# Altium schematic sheet Power management.SchDoc
size A4; SheetNumber: 2; SheetTotal: 4
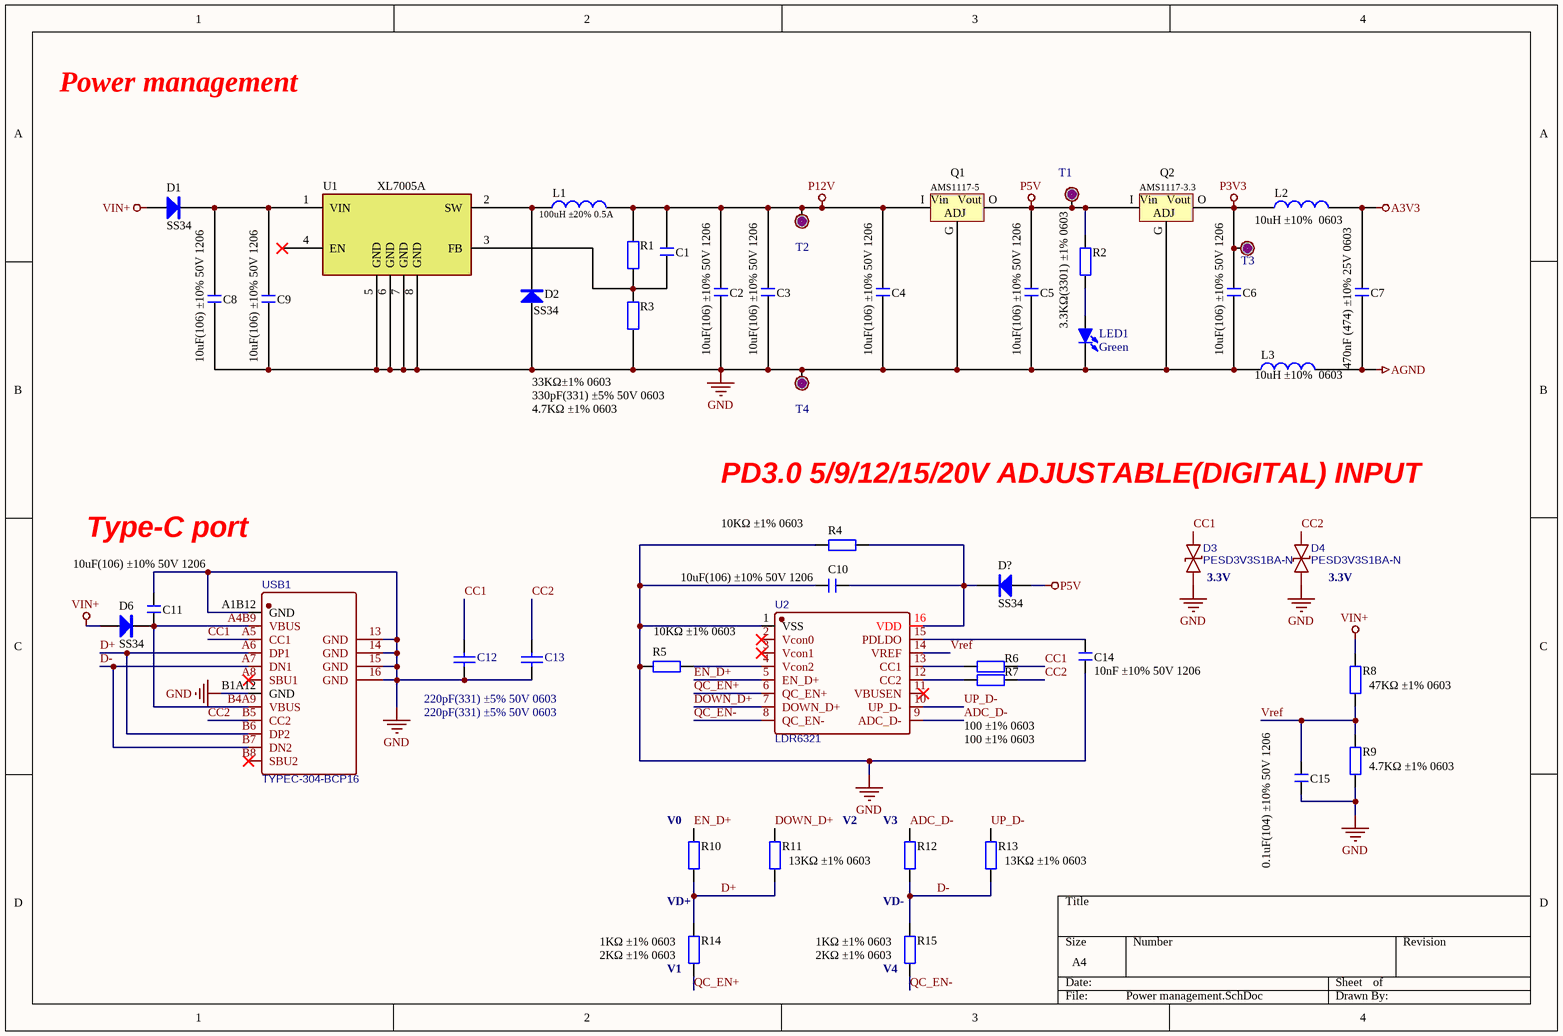
[diagram p0: Power management.SchDoc]

## Parts
C1  330pF(331) ±5% 50V 0603  [C 0603_L]
C2  10uF(106) ±10% 50V 1206  [C 1206_M]
C3  10uF(106) ±10% 50V 1206  [C 1206_M]
C4  10uF(106) ±10% 50V 1206  [C 1206_M]
C5  10uF(106) ±10% 50V 1206  [C 1206_M]
C6  10uF(106) ±10% 50V 1206  [C 1206_M]
C7  470nF (474) ±10% 25V 0603  [C 0603_L]
C8  10uF(106) ±10% 50V 1206  [C 1206_M]
C9  10uF(106) ±10% 50V 1206  [C 1206_M]
C10  10uF(106) ±10% 50V 1206  [C 1206_M]
C11  10uF(106) ±10% 50V 1206  [C 1206_M]
C12  220pF(331) ±5% 50V 0603  [C0603_L]
C13  220pF(331) ±5% 50V 0603  [C0603_L]
C14  10nF ±10% 50V 1206  [C 1206_M]
C15  0.1uF(104) ±10% 50V 1206  [C 1206_M]
D1  SS34  [SMA]
D2  SS34  [SMA]
D3  PESD3V3S1BA-N  [SOD-523_L1.2-W0.8-LS1.6-BI]
D4  PESD3V3S1BA-N  [SOD-523_L1.2-W0.8-LS1.6-BI]
D6  SS34  [SMA]
D?  SS34  [SMA]
L1  100uH ±20% 0.5A  [CDRH74]
L2  10uH ±10%  0603  [L 0603]
L3  10uH ±10%  0603  [L 0603]
LED1  Green  [LED 0603R]
Q1  AMS1117-5  [SOT-223]
Q2  AMS1117-3.3  [SOT-223]
R1  33KΩ±1% 0603  [R 0603_L]
R2  3.3KΩ(3301) ±1% 0603  [R 0603_L]
R3  4.7KΩ ±1% 0603  [R 0603_L]
R4  10KΩ ±1% 0603  [R 0603_L]
R5  10KΩ ±1% 0603  [R 0603_L]
R6  100 ±1% 0603  [R 0603_L]
R7  100 ±1% 0603  [R 0603_L]
R8  47KΩ ±1% 0603  [R 0603_L]
R9  4.7KΩ ±1% 0603  [R 0603_L]
R10  1KΩ ±1% 0603  [R 0603_L]
R11  13KΩ ±1% 0603  [R 0603_L]
R12  1KΩ ±1% 0603  [R 0603_L]
R13  13KΩ ±1% 0603  [R 0603_L]
R14  2KΩ ±1% 0603  [R 0603_L]
R15  2KΩ ±1% 0603  [R 0603_L]
T1  TestP  [TestP]  (value not drawn)
T2  TestP  [TestP]  (value not drawn)
T3  TestP  [TestP]  (value not drawn)
T4  TestP  [TestP]  (value not drawn)
U1  XL7005A  [SOP8-EP]
U2  LDR6321  [SSOP-16_L5.0-W4.4-P0.65-LS6.4-BL]
USB1  TYPEC-304-BCP16  [USB-C-SMD_TYPEC-304-BCP16]

## Nets
A3V3: C7.1 L2.2
AGND: C7.2 L3.2
GND: C2.1 C3.1 C4.1 C5.1 C6.1 C8.1 C9.1 C10.2 C11.2 C12.1 C13.1 C14.1 C15.1 D2.1(A) D3.1 D4.1 L3.1 LED1.2(K) Q1.G Q2.G R3.2 R4.1 R5.1 R9.1 T4.0 U1.5(GND) U1.6(GND) U1.7(GND) U1.8(GND) U2.1(VSS) USB1.13(GND) USB1.14(GND) USB1.15(GND) USB1.16(GND) USB1.A1B12(GND) USB1.B1A12(GND)
P3V3: C6.2 L2.1 Q2.O(OUT) T3.0
P5V: C5.2 D?.1(A) Q1.O(OUT) Q2.I(IN) R2.1 T1.0
P12V: C1.2 C2.2 C3.2 C4.2 L1.2 Q1.I(IN) R1.1 T2.0
VIN+: D1.1(A) D6.1(A) R8.2
ADC_D-: R12.2 U2.9(ADC_D-)
CC1: C12.2 D3.2 R6.2 USB1.A5(CC1)
CC2: C13.2 D4.2 R7.2 USB1.B5(CC2)
D+: R10.1 R11.1 R14.2 USB1.A6(DP1) USB1.B6(DP2)
D-: R12.1 R13.1 R15.2 USB1.A7(DN1) USB1.B7(DN2)
DOWN_D+: R11.2 U2.7(DOWN_D+)
EN_D+: R10.2 U2.5(EN_D+)
QC_EN+: R14.1 U2.6(QC_EN+)
QC_EN-: R15.1 U2.8(QC_EN-)
UP_D-: R13.2 U2.10(UP_D-)
Vref: C15.2 R8.1 R9.2 U2.14(VREF)
NetC1_1: C1.1 R1.2 R3.1 U1.3(FB)
NetC8_2: C8.2 C9.2 D1.2(K) U1.1(VIN)
NetC10_1: C10.1 D?.2(K) R4.2 U2.16(VDD)
NetC11_1: C11.1 D6.2(K) USB1.A4B9(VBUS) USB1.B4A9(VBUS)
NetC14_2: C14.2 U2.15(PDLDO)
NetD2_2: D2.2(K) L1.1 U1.2(SW)
NetLED1_1: LED1.1(A) R2.2
NetR5_2: R5.2 U2.4(Vcon2)
NetR6_1: R6.1 U2.13(CC1)
NetR7_1: R7.1 U2.12(CC2)

Not connected (* = marked no-connect by the designer): U1 4(EN)*; U2 2(Vcon0)* 3(Vcon1)* 11(VBUSEN)*; USB1 A8(SBU1)* B8(SBU2)*

## Notes on the sheet
- Power management
- PD3.0 5/9/12/15/20V ADJUSTABLE(DIGITAL) INPUT
- Type-C port
- (near D3) 3.3V
- (near D4) 3.3V
- (near R10) V0
- V2
- (near R12) V3
- VD+
- VD-
- (near R14) V1
- (near R15) V4
- (in symbol NCP1117ST50T3G) Vin; Vout; ADJ

## Library data of the parts
C1-C11 C14 C15 = C: 贴片电容; BOM名称: 无极性贴片电容; 淘宝ID: 封装库来自淘宝 ID：黄晶宝石; 联系售后，技术支持: https://shop463601444.taobao.com; 唯一出售店铺网址: https://shop463601444.taobao.com
C12 C13 = C: 贴片电容/MLCC电容; BOM名称: 无极性贴片电容; 联系卖家，免费查找封装: 唯一出售店铺网址https://shop463601444.taobao.com
D1 D2 D6 D? = 1N4007: 整流二极管; 淘宝ID: 封装库来自淘宝 ID：黄晶宝石; 封装库来自淘宝卖家 ID：黄晶宝石: 其他店铺购入均为盗版，不享受售后技术支持服务，请立即申请退款; BOM名称: 整流二极管; 联系售后，技术支持: https://shop463601444.taobao.com
D3 D4 = PESD3V3S1BA-N: TVS3V3; BOM_Manufacturer: Bourne Semicon (Shenzhen); Contributor: LCSC; BOM_Supplier: LCSC; BOM_Supplier Part: C316037; BOM_Manufacturer Part: PESD3V3S1BA-N; BOM_JLCPCB Part Class: Extended Part; spicePre: D; spiceSymbolName: PESD3V3S1BA-N
L1 = Inductor
L2 L3 = L: 小功率贴片电感; 淘宝ID: 封装库来自淘宝 ID：黄晶宝石; 封装库来自淘宝卖家 ID：黄晶宝石: 其他店铺购入均为盗版，不享受售后技术支持服务，请立即申请退款; BOM名称: 小功率贴片电感; 联系售后: https://shop463601444.taobao.com
LED1 = LED-SMD: 贴片LED; 版权归属: 封装库来自淘宝 ID：黄晶宝石; BOM名称: 贴片LED; 学习资源: https://shop463601444.taobao.com
Q1 Q2 = NCP1117ST50T3G
R1-R15 = R: 贴片电阻; 版权归属: 来自淘宝 ID：黄晶宝石; 封装库来自淘宝卖家 ID：黄晶宝石: 其他店铺购入均为盗版，不享受售后技术支持服务，请立即申请退款; BOM名称: 贴片电阻; 联系售后: https://shop463601444.taobao.com
U2 = LDR6321: BOM_Manufacturer: Legendary(乐得瑞); Contributor: LCSC; BOM_Supplier: LCSC; BOM_Supplier Part: C2919632; BOM_Manufacturer Part: LDR6321; BOM_JLCPCB Part Class: Extended Part; spicePre: U; spiceSymbolName: LDR6321
USB1 = TYPEC-304-BCP16: BOM_Manufacturer: XUNPU; Contributor: LCSC; BOM_Supplier: LCSC; BOM_Supplier Part: C720629; BOM_Manufacturer Part: TYPEC-304-BCP16; BOM_JLCPCB Part Class: Extended Part; spicePre: U; spiceSymbolName: TYPEC-304-BCP16